# Altium schematic sheet USBHUB.SchDoc
size A3
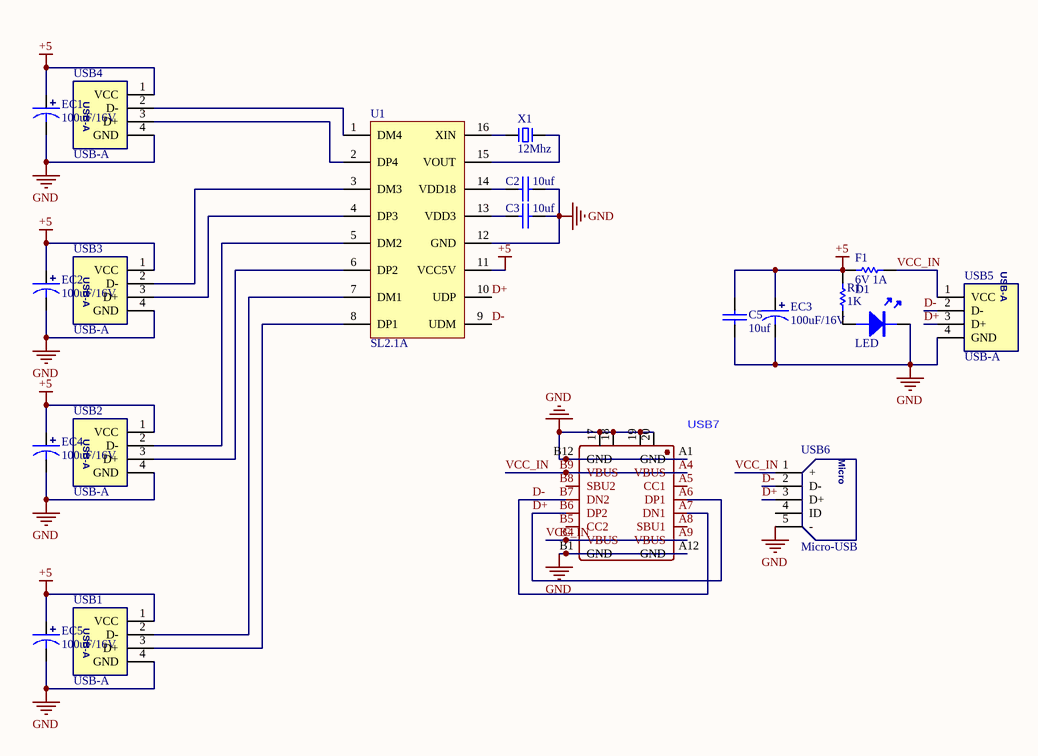
[diagram p0: USBHUB.SchDoc]

## Parts
C2  10uf  [0805C]
C3  10uf  [0805C]
C5  10uf  [0805C]
D1  LED  [LED-0805R]
EC1  100uF/16V  [SMD-EC6.3X6.3X10]
EC2  100uF/16V  [SMD-EC6.3X6.3X10]
EC3  100uF/16V  [SMD-EC6.3X6.3X10]
EC4  100uF/16V  [SMD-EC6.3X6.3X10]
EC5  100uF/16V  [SMD-EC6.3X6.3X10]
F1  6V 1A  [0805R]
R1  1K  [0805R]
U1  SL2.1A  [SOP16]
USB1  USB-A  [USB-A/S_A]
USB2  USB-A  [USB-A/S_A]
USB3  USB-A  [USB-A/S_A]
USB4  USB-A  [USB-A/S_A]
USB5  USB-A  [USB-A/S_A]
USB6  Micro-USB  [USB-MICRO_A]
USB7  (no value)  [TYPE-C]
X1  12Mhz  [OSC HC-49S]

## Nets
+5: C5.2 EC1.1 EC2.1 EC3.1 EC4.1 EC5.1 F1.2 R1.2 U1.11(VCC5V) USB1.1(VCC) USB2.1(VCC) USB3.1(VCC) USB4.1(VCC)
GND: C2.1 C3.1 C5.1 D1.K EC1.2 EC2.2 EC3.2 EC4.2 EC5.2 U1.12(GND) USB1.4(GND) USB2.4(GND) USB3.4(GND) USB4.4(GND) USB5.4(GND) USB6.5(-) USB7.17 USB7.18 USB7.19 USB7.20 USB7.A1(GND) USB7.A12(GND) USB7.B1(GND) USB7.B12(GND)
D+: U1.10(UDP) USB5.3(D+) USB6.3(D+) USB7.A6(DP1) USB7.B6(DP2)
D-: U1.9(UDM) USB5.2(D-) USB6.2(D-) USB7.A7(DN1) USB7.B7(DN2)
VCC_IN: F1.1 USB5.1(VCC) USB6.1(+) USB7.A4(VBUS) USB7.A9(VBUS) USB7.B4(VBUS) USB7.B9(VBUS)
NetC2_2: C2.2 U1.14(VDD18)
NetC3_2: C3.2 U1.13(VDD3)
NetD1_A: D1.A R1.1
NetU1_1: U1.1(DM4) USB4.2(D-)
NetU1_2: U1.2(DP4) USB4.3(D+)
NetU1_3: U1.3(DM3) USB3.2(D-)
NetU1_4: U1.4(DP3) USB3.3(D+)
NetU1_5: U1.5(DM2) USB2.2(D-)
NetU1_6: U1.6(DP2) USB2.3(D+)
NetU1_7: U1.7(DM1) USB1.2(D-)
NetU1_8: U1.8(DP1) USB1.3(D+)
NetU1_15: U1.15(VOUT) X1.2
NetU1_16: U1.16(XIN) X1.1

Not connected (* = marked no-connect by the designer): USB6 4(ID); USB7 A5(CC1) A8(SBU1) B5(CC2) B8(SBU2)

## Notes on the sheet
- (in symbol Micro-USB) Micro

## Library data of the parts
C2 C3 C5 = CAP: 无极性电容
EC1-EC5 = SMD_ECAP: 贴片电解电容
F1 R1 = RES
USB7 = TYPE-C-16M-0243MD
X1 = XTAL-2P: 2脚无源脚晶振